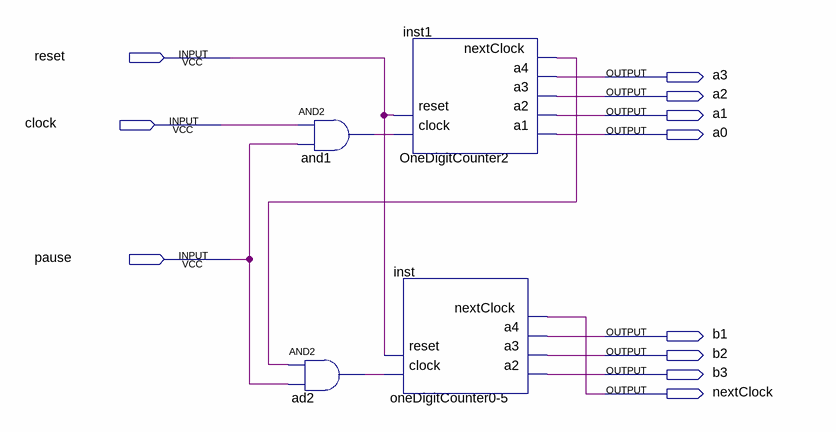
[diagram p0: schematic sheet]
// Quartus schematic cronometroSeg.bdf as structural Verilog: 4 symbols, 11 pins
module cronometroSeg (
  input  reset,
  input  clock,
  input  pause,
  output a3,
  output a2,
  output a1,
  output a0,
  output b1,
  output b2,
  output b3,
  output nextClock
);

  wire ad2_out, and1_out, inst1_nextclock;

  and and1 (and1_out, clock, pause);
  and ad2 (ad2_out, inst1_nextclock, pause);
  OneDigitCounter2 inst1 (
    .clock(and1_out), .reset(reset), .a1(a0), .a2(a1), .a3(a2), .a4(a3), .nextClock(inst1_nextclock));
  \oneDigitCounter0-5  inst (.clock(ad2_out), .reset(reset), .a2(b3), .a3(b2), .a4(b1), .nextClock(nextClock));
endmodule
